# Altium project Wenzel_REF.PrjPCB (part 1 of 7)
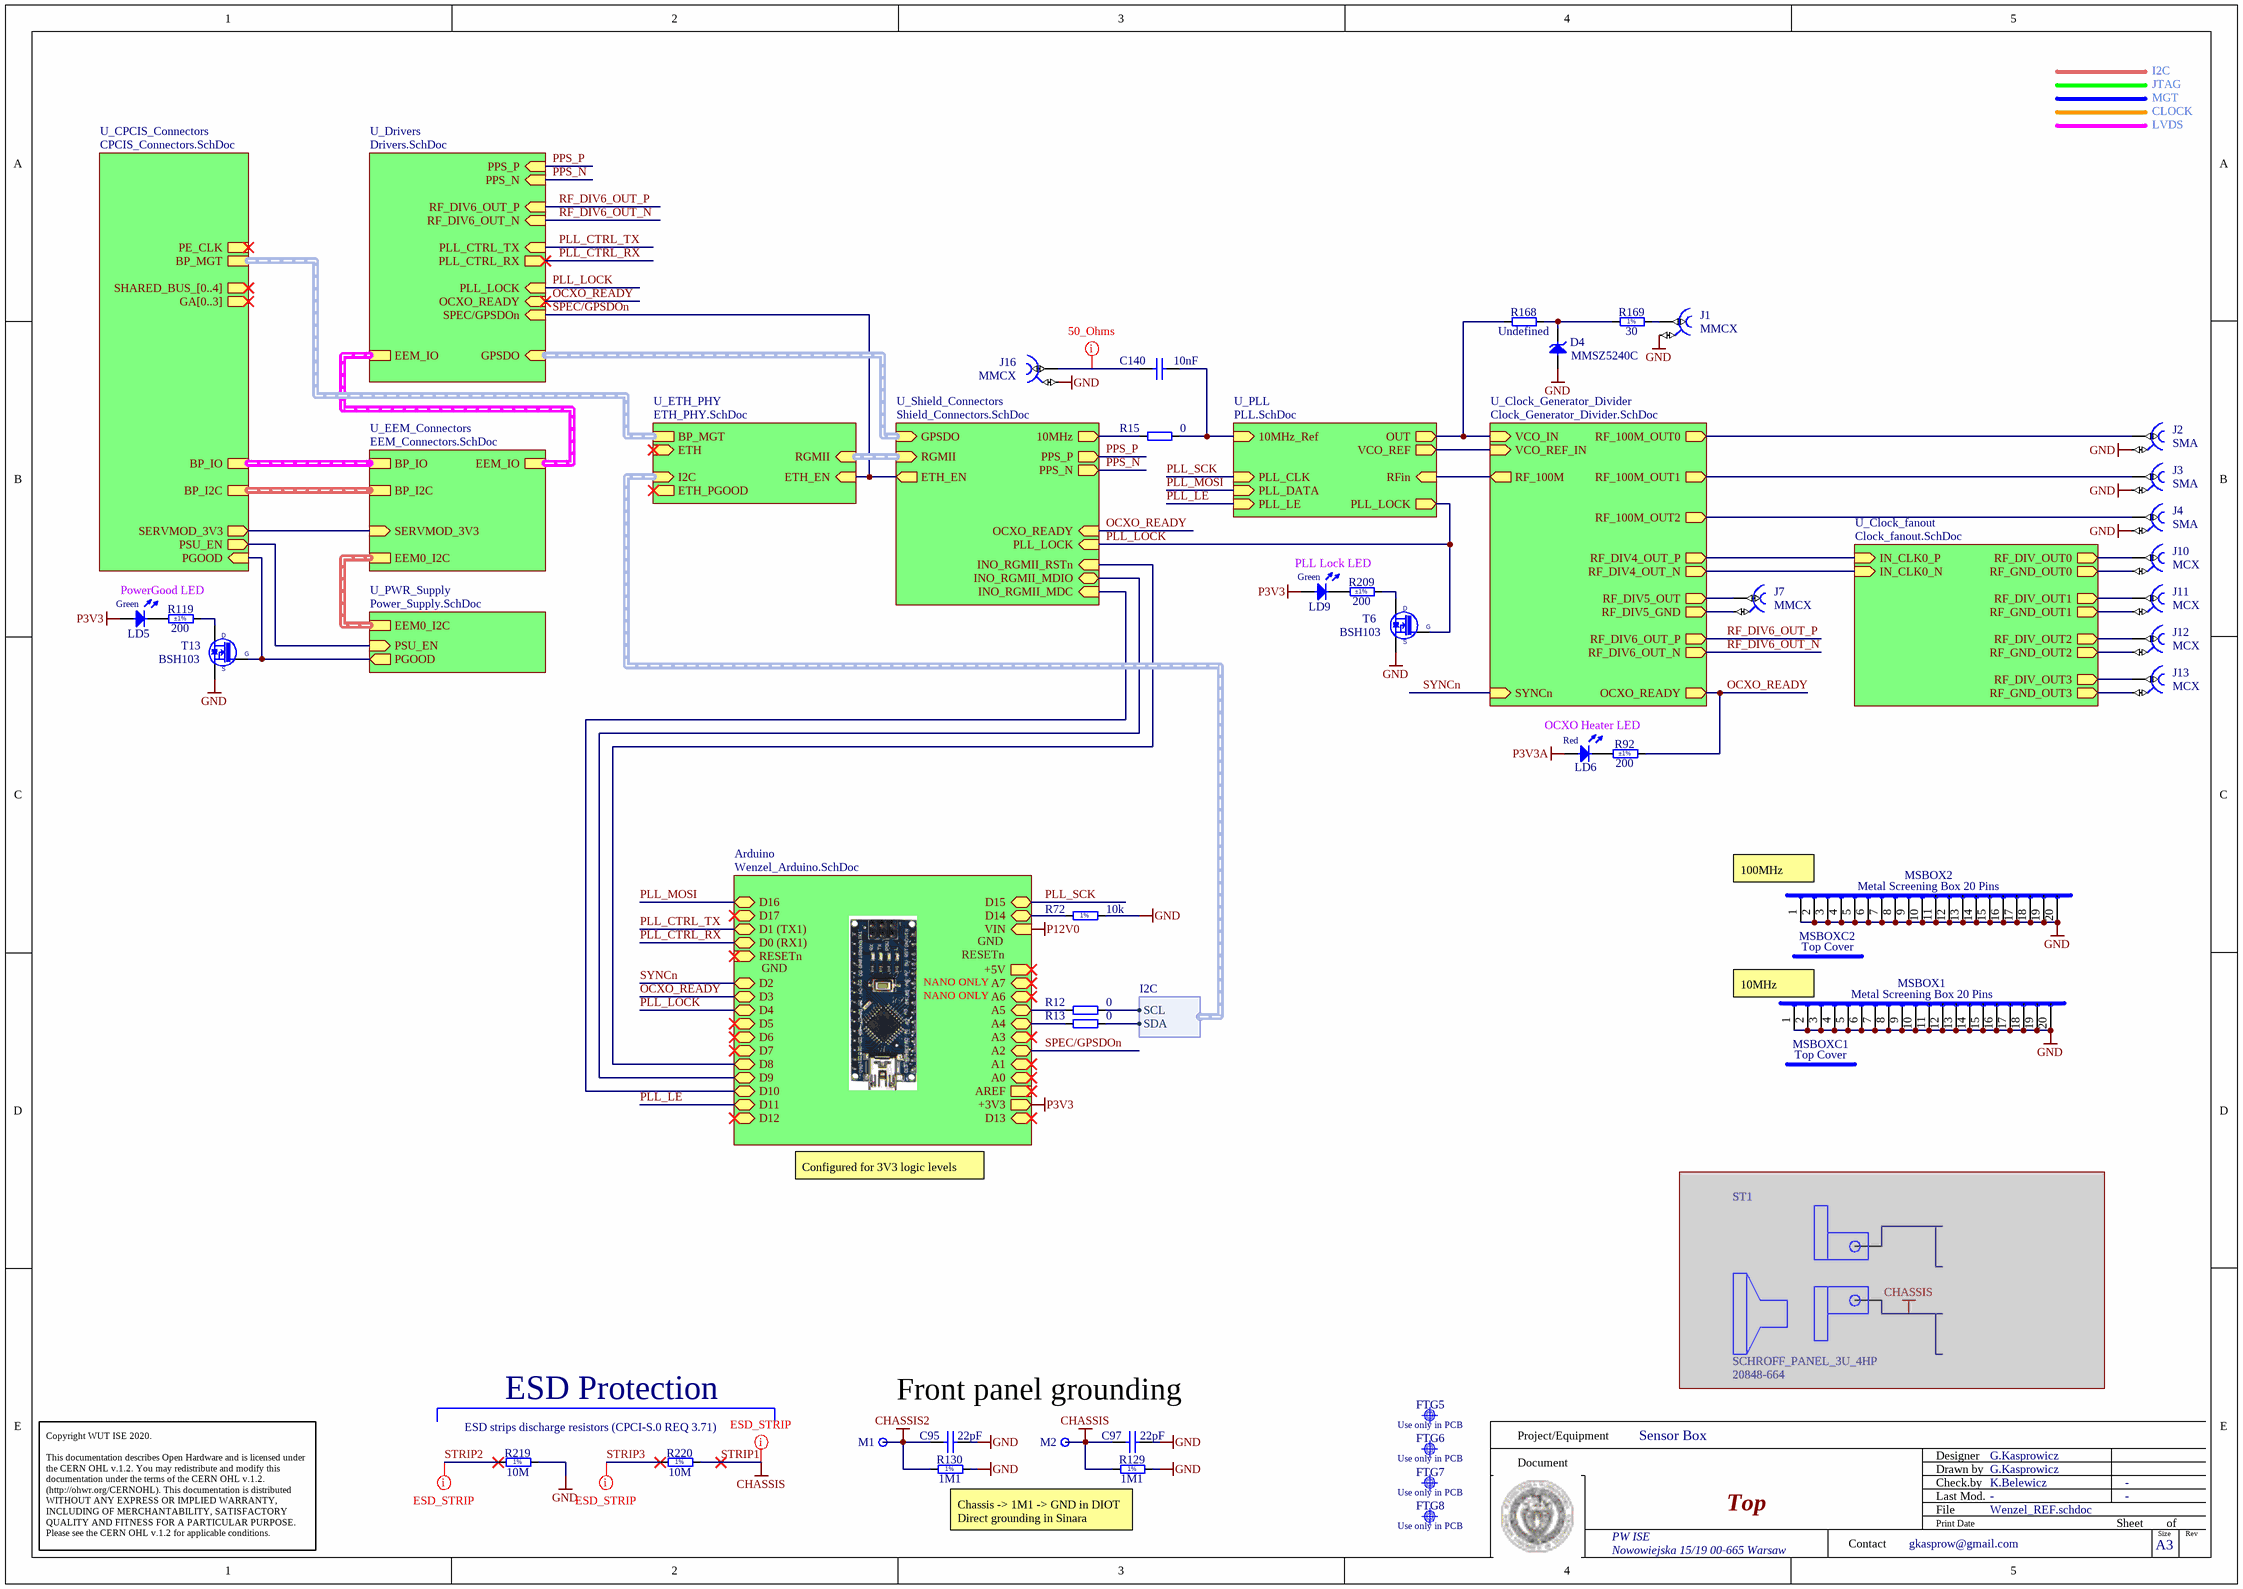
[diagram p0: Wenzel_REF.schdoc]
SheetTitle_Top: Wenzel-class Freq. Reference; ProjectRev: 1.1; Project: Wenzel; CheckedBy: K.Belewicz
11 sheets, 615 parts. Net scope: hierarchical (ports join the sheet entries above them; power ports are global).
Board file: Wenzel_REF.PCBDOC
Sheets:
  Wenzel_REF.schdoc
    U_Drivers = Drivers.SchDoc
    U_Clock_fanout = Clock_fanout.SchDoc
    U_Clock_Generator_Divider = Clock_Generator_Divider.SchDoc
    U_Shield_Connectors = Shield_Connectors.SchDoc
    U_ETH_PHY = ETH_PHY.SchDoc
    U_PWR_Supply = Power_Supply.SchDoc
    U_CPCIS_Connectors = CPCIS_Connectors.SchDoc
    U_EEM_Connectors = EEM_Connectors.SchDoc
    U_PLL = PLL.SchDoc
    Arduino = Wenzel_Arduino.SchDoc

## Sheet Wenzel_REF.schdoc: =SheetTitle_Top
size 420 x 297 mm; EDA_Number: ARTIQ; Projet: Wenzel; Author: G.Kasprowicz; CompanyName: WUT ISE; DrawnBy: G.Kasprowicz; Organization: WUT ISE; Address1: PW ISE; Address2: Nowowiejska 15/19 00-665 Warsaw; Address3: gkasprow@gmail.com; Revision: 1.1; ModifiedBy: -; CheckedDate: -; Title2: Top; DivGrp: WUT ISE; Designer: G.Kasprowicz; ModifiedDate: -; ProjectName: Sensor Box

### Parts
(Parts that share a designator on the sheet are numbered #1, #2 ... from top to bottom, then left to right.)
C95  22pF  [CAPC1005X55N]
C97  22pF  [CAPC1005X55N]
C140#1  10nF  [CAPC1005X55N]
D4  MMSZ5240C  [SOD3716X135N]
FTG5  Use only in PCB  [FIDUCIAL_TOP_C100-200]  (no BOM)
FTG6  Use only in PCB  [FIDUCIAL_TOP_S100-200]  (no BOM)
FTG7  Use only in PCB  [FIDUCIAL_TOP_S100-200]  (no BOM)
FTG8  Use only in PCB  [FIDUCIAL_TOP_S100-200]  (no BOM)
J1  MMCX  [SAMTEC_MMCX-J-P-H-ST-TH1]
J2  SMA  [MOLEX_73251-2120]
J3  SMA  [MOLEX_73251-2120]
J4  SMA  [MOLEX_73251-2120]
J7#1  MMCX  [SAMTEC_MMCX-J-P-H-ST-TH1]
J10  MCX  [AMPHENOL_919-383J-51A]
J11  MCX  [AMPHENOL_919-383J-51A]
J12  MCX  [AMPHENOL_919-383J-51A]
J13  MCX  [AMPHENOL_919-383J-51A]
J16  MMCX  [SAMTEC_MMCX-J-P-H-ST-TH1]
LD5  Green  [LED_DIALIGHT_555-230]
LD6  Red  [LED_DIALIGHT_555-200]
LD9  Green  [LED_DIALIGHT_555-230]
M1  Plated Hole  [MTG300_600]  (value not drawn)  (no BOM)
M2  Plated Hole  [MTG300_600]  (value not drawn)  (no BOM)
MSBOX1  Metal Screening Box 20 Pins  [MSBOX_LAIRD_BMI-S-204-F]
MSBOX2  Metal Screening Box 20 Pins  [MSBOX_LAIRD_BMI-S-204-F]
MSBOXC1  Top Cover  [MSBOX_LAIRD_BMI-S-204-C]
MSBOXC2  Top Cover  [MSBOX_LAIRD_BMI-S-204-C]
R12  0  [RESC1005X40N]
R13  0  [RESC1005X40N]
R15  0  [RESC1005X40N]
R72#1  10k  [RESC1005X40N]
R92  200  Tolerance: ±1%  [RESC1005X40N]
R119  200  Tolerance: ±1%  [RESC1005X40N]
R129  1M1  [RESC2012X60N]
R130  1M1  [RESC2012X60N]
R168  Undefined  [RESC1608X55N]
R169  30  [RESC1608X55N]
R209#1  200  Tolerance: ±1%  [RESC1005X40N]
R219  10M  [RESC2113X55N]
R220  10M  [RESC2113X55N]
ST1  SCHROFF_PANEL_3U_4HP  Manufacturer Part Number 2: 20848-664  [SCHROFF_PANEL_3HP_4U]  (masked out: inside a compile mask, not in the netlist)
T6  BSH103  [SOT95P230X110-3N]
T13  BSH103  [SOT95P230X110-3N]

### Sub-sheets
Arduino = Wenzel_Arduino.SchDoc: D16 (bidir), D2 (bidir), D3 (bidir), D1 (TX1) (bidir), D17 (bidir), D7 (bidir), D8 (bidir), D9 (bidir), D14 (bidir), D11 (bidir), D0 (RX1) (bidir), D10 (bidir), D6 (bidir), D15 (bidir), D4 (bidir), D5 (bidir), D12 (bidir), A7 (bidir), D13 (bidir), +3V3 (out), +5V (out), AREF, A1 (bidir), A3 (bidir), A4 (bidir), A2 (bidir), VIN (in), RESETn (in), A6 (bidir), A5 (bidir), A0 (bidir)
U_Clock_fanout = Clock_fanout.SchDoc: IN_CLK0_P (in), IN_CLK0_N (in), RF_DIV_OUT0 (out), RF_GND_OUT0 (out), RF_DIV_OUT1 (out), RF_DIV_OUT2 (out), RF_DIV_OUT3 (out), RF_GND_OUT1 (out), RF_GND_OUT2 (out), RF_GND_OUT3 (out)
U_Clock_Generator_Divider = Clock_Generator_Divider.SchDoc: RF_100M_OUT0 (out), RF_100M_OUT1 (out), RF_100M_OUT2 (out), SYNCn (in), VCO_IN (in), VCO_REF_IN (in), OCXO_READY (out), RF_DIV4_OUT_P (out), RF_DIV4_OUT_N (out), RF_DIV5_OUT (out), RF_DIV5_GND (out), RF_DIV6_OUT_P (out), RF_DIV6_OUT_N (out), RF_100M (out)
U_CPCIS_Connectors = CPCIS_Connectors.SchDoc: BP_I2C (harness I2C), SERVMOD_3V3 (out), PSU_EN (out), PE_CLK (harness CLK_DIFF), BP_MGT (harness MGT), GA[0..3] (out), BP_IO (harness EEM_LVDS), SHARED_BUS_[0..4] (out), PGOOD (in)
U_Drivers = Drivers.SchDoc: OCXO_READY (in), RF_DIV6_OUT_P (in), RF_DIV6_OUT_N (in), EEM_IO (harness EEM_LVDS), GPSDO (in, harness GPSDO), SPEC/GPSDOn (in), PLL_LOCK (in), PLL_CTRL_TX (in), PLL_CTRL_RX (out), PPS_P (in), PPS_N (in)
U_EEM_Connectors = EEM_Connectors.SchDoc: EEM_IO (harness EEM_LVDS), BP_IO (harness EEM_LVDS), EEM0_I2C (harness I2C), BP_I2C (harness I2C), SERVMOD_3V3 (in)
U_ETH_PHY = ETH_PHY.SchDoc: ETH_EN (in), ETH_PGOOD (out), RGMII (in, harness RGMII), I2C (in, harness I2C), ETH (in, harness SERDES), BP_MGT (harness MGT)
U_PLL = PLL.SchDoc: OUT (out), VCO_REF (out), 10MHz_Ref (in), RFin (in), PLL_CLK (in), PLL_LOCK (out), PLL_DATA (in), PLL_LE (in)
U_PWR_Supply = Power_Supply.SchDoc: PSU_EN (in), EEM0_I2C (harness I2C), PGOOD (out)
U_Shield_Connectors = Shield_Connectors.SchDoc: RGMII (in, harness RGMII), ETH_EN (out), 10MHz (out), PPS_P (out), GPSDO (in, harness GPSDO), PLL_LOCK (in), OCXO_READY (in), INO_RGMII_RSTn (in), INO_RGMII_MDIO (bidir), INO_RGMII_MDC (in), PPS_N (out)

### Harnesses
I2C: SCL, SDA

### Nets
CHASSIS: C97.1 M2.1 R129.1 R220.2  [also labelled STRIP1]
CHASSIS2: C95.1 M1.1 R130.1
GND: C95.2 C97.2 D4.2(A) J1.2 J2.2 J3.2 J4.2 J16.2 MSBOX1.1 MSBOX1.2 MSBOX1.3 MSBOX1.4 MSBOX1.5 MSBOX1.6 MSBOX1.7 MSBOX1.8 MSBOX1.9 MSBOX1.10 MSBOX1.11 MSBOX1.12 MSBOX1.13 MSBOX1.14 MSBOX1.15 MSBOX1.16 MSBOX1.17 MSBOX1.18 MSBOX1.19 MSBOX1.20 MSBOX2.1 MSBOX2.2 MSBOX2.3 MSBOX2.4 MSBOX2.5 MSBOX2.6 MSBOX2.7 MSBOX2.8 MSBOX2.9 MSBOX2.10 MSBOX2.11 MSBOX2.12 MSBOX2.13 MSBOX2.14 MSBOX2.15 MSBOX2.16 MSBOX2.17 MSBOX2.18 MSBOX2.19 MSBOX2.20 R72#1.2 R129.2 R130.2 R219.2 T6.2(S) T13.2(S)
P3V3: LD5.2(A) LD9.2(A) ; sheet Arduino/+3V3
P3V3A: LD6.2(A)
10MHz: R15.2 ; sheet U_Shield_Connectors/10MHz
10MHz_Ref: C140#1.1 R15.1 ; sheet U_PLL/10MHz_Ref
A4: R13.2 ; sheet Arduino/A4
A5: R12.2 ; sheet Arduino/A5
D8: sheet U_Shield_Connectors/INO_RGMII_RSTn, sheet Arduino/D8
D9: sheet U_Shield_Connectors/INO_RGMII_MDIO, sheet Arduino/D9
D10: sheet U_Shield_Connectors/INO_RGMII_MDC, sheet Arduino/D10
D14 (MISO): R72#1.1 ; sheet Arduino/D14
IN_CLK0_N: sheet U_Clock_fanout/IN_CLK0_N, sheet U_Clock_Generator_Divider/RF_DIV4_OUT_N
IN_CLK0_P: sheet U_Clock_fanout/IN_CLK0_P, sheet U_Clock_Generator_Divider/RF_DIV4_OUT_P
OCXO_READY: R92.2 ; sheet U_Drivers/OCXO_READY, sheet U_Clock_Generator_Divider/OCXO_READY, sheet U_Shield_Connectors/OCXO_READY, sheet Arduino/D3  [project net D3]
PGOOD: T13.1(G) ; sheet U_PWR_Supply/PGOOD, sheet U_CPCIS_Connectors/PGOOD
PLL_CTRL_RX: sheet U_Drivers/PLL_CTRL_RX, sheet Arduino/D0 (RX1)
PLL_CTRL_TX: sheet U_Drivers/PLL_CTRL_TX, sheet Arduino/D1 (TX1)
PLL_LE: sheet U_PLL/PLL_LE, sheet Arduino/D11  [project net D11]
PLL_LOCK: T6.1(G) ; sheet U_Drivers/PLL_LOCK, sheet U_Shield_Connectors/PLL_LOCK, sheet U_PLL/PLL_LOCK, sheet Arduino/D4  [project net D4]
PLL_MOSI: sheet U_PLL/PLL_DATA, sheet Arduino/D16
PLL_SCK: sheet U_PLL/PLL_CLK, sheet Arduino/D15  [project net D15 (SCK)]
PPS_N: sheet U_Drivers/PPS_N, sheet U_Shield_Connectors/PPS_N  [project net DELAY_Q1_N]
PPS_P: sheet U_Drivers/PPS_P, sheet U_Shield_Connectors/PPS_P  [project net DELAY_Q1_P]
PSU_EN: sheet U_PWR_Supply/PSU_EN, sheet U_CPCIS_Connectors/PSU_EN
RF_100M: sheet U_Clock_Generator_Divider/RF_100M, sheet U_PLL/RFin
RF_100M_OUT0: J2.1 ; sheet U_Clock_Generator_Divider/RF_100M_OUT0
RF_100M_OUT1: J3.1 ; sheet U_Clock_Generator_Divider/RF_100M_OUT1
RF_100M_OUT2: J4.1 ; sheet U_Clock_Generator_Divider/RF_100M_OUT2
RF_DIV5_GND: J7#1.2 ; sheet U_Clock_Generator_Divider/RF_DIV5_GND
RF_DIV5_OUT: J7#1.1 ; sheet U_Clock_Generator_Divider/RF_DIV5_OUT
RF_DIV6_OUT_N: sheet U_Drivers/RF_DIV6_OUT_N, sheet U_Clock_Generator_Divider/RF_DIV6_OUT_N  [project net EEM_IO.LVDS_N0]
RF_DIV6_OUT_P: sheet U_Drivers/RF_DIV6_OUT_P, sheet U_Clock_Generator_Divider/RF_DIV6_OUT_P  [project net EEM_IO.LVDS_P0]
RF_DIV_OUT0: J10.1 ; sheet U_Clock_fanout/RF_DIV_OUT0
RF_DIV_OUT1: J11.1 ; sheet U_Clock_fanout/RF_DIV_OUT1
RF_DIV_OUT2: J12.1 ; sheet U_Clock_fanout/RF_DIV_OUT2
RF_DIV_OUT3: J13.1 ; sheet U_Clock_fanout/RF_DIV_OUT3
RF_GND_OUT0: J10.2 ; sheet U_Clock_fanout/RF_GND_OUT0
RF_GND_OUT1: J11.2 ; sheet U_Clock_fanout/RF_GND_OUT1
RF_GND_OUT2: J12.2 ; sheet U_Clock_fanout/RF_GND_OUT2
RF_GND_OUT3: J13.2 ; sheet U_Clock_fanout/RF_GND_OUT3
SERVMOD_3V3: sheet U_CPCIS_Connectors/SERVMOD_3V3, sheet U_EEM_Connectors/SERVMOD_3V3
SPEC/GPSDOn: sheet U_Drivers/SPEC/GPSDOn, sheet U_Shield_Connectors/ETH_EN, sheet U_ETH_PHY/ETH_EN, sheet Arduino/A2  [project net A2]
STRIP2: R219.1
STRIP3: R220.1
SYNCn: sheet U_Clock_Generator_Divider/SYNCn, sheet Arduino/D2  [project net D2]
VCO_IN: R168.1 ; sheet U_Clock_Generator_Divider/VCO_IN, sheet U_PLL/OUT
VCO_REF_IN: sheet U_Clock_Generator_Divider/VCO_REF_IN, sheet U_PLL/VCO_REF
NetC140#1_2: C140#1.2 J16.1
NetD4_1: D4.1(C) R168.2 R169.1
NetIC20_3: R13.1 ; sheet U_ETH_PHY/I2C.SDA
NetIC20_4: R12.1 ; sheet U_ETH_PHY/I2C.SCL
NetJ1_1: J1.1 R169.2
NetLD5_1: LD5.1(C) R119.1
NetLD6_1: LD6.1(C) R92.1
NetLD9_1: LD9.1(C) R209#1.1
NetR119_2: R119.2 T13.3(D)
NetR209#1_2: R209#1.2 T6.3(D)

### Buses and harness runs
harness sheet U_CPCIS_Connectors/BP_I2C = sheet U_EEM_Connectors/BP_I2C
harness sheet U_CPCIS_Connectors/BP_IO = sheet U_EEM_Connectors/BP_IO
harness sheet U_CPCIS_Connectors/BP_MGT = sheet U_ETH_PHY/BP_MGT
harness sheet U_Drivers/EEM_IO = sheet U_EEM_Connectors/EEM_IO
harness sheet U_Drivers/GPSDO = sheet U_Shield_Connectors/GPSDO
harness sheet U_EEM_Connectors/EEM0_I2C = sheet U_PWR_Supply/EEM0_I2C
harness sheet U_ETH_PHY/RGMII = sheet U_Shield_Connectors/RGMII

### Layout directives
net class ESD_STRIP: CHASSIS, STRIP2, STRIP3
net class 50_Ohms: NetC140#1_2

### Notes on the sheet
- I2C
- JTAG
- MGT
- CLOCK
- LVDS
- PowerGood LED
- PLL Lock LED
- OCXO Heater LED
- (near MSBOX2) 100MHz
- GND
- NANO ONLY
- RESETn
- 10MHz
- Configured for 3V3 logic levels
- ESD Protection
- Front panel grounding
- ESD strips discharge resistors (CPCI-S.0 REQ 3.71)
- Chassis -> 1M1 -> GND in DIOT
  Direct grounding in Sinara
- Project/Equipment
- Document
- Designer
- Drawn by
- Check.by
- Copyright WUT ISE 2020.
  This documentation describes Open Hardware and is licensed under the CERN OHL v.1.2. You may redistribute and modify this documentation under the terms of the CERN OHL v.1.2. (http://ohwr.org/CERNOHL). This documentation is distributed WITHOUT ANY EXPRESS OR IMPLIED WARRANTY, INCLUDING OF MERCHANTABILITY, SATISFACTORY QUALITY AND FITNESS FOR A PARTICULAR PURPOSE. Please see the CERN OHL v.1.2 for applicable conditions.
- Contact
- File
- Last Mod.
- Print Date
- Sheet
- Size
- A3
- of
- Rev
- (in symbol R0402_10K_1%_0.0625W_100PPM) 1%
- (in symbol R0603_30R_1%_0.1W_100PPM) 1%
- (in symbol R0805_1M1_1%_0.125W_100PPM) 1%
- (in symbol R0805_10M_1%_0.125W_100PPM_VISHAY_CRCW e3) 1%

### Library data of the parts
C95 C97 = CC0402_22PF_50V_5%_C0G: Non-polarised capacitor; Part Description: SMD Multilayer Chip Ceramic Capacitor; Manufacturer: GENERIC; Manufacturer1 Part Number: C0402C220J5GACTU; Voltage: 50V; TC: C0G/NP0; Tolerance: ±5%; Part Number: CC0402_22PF_50V_5%_C0G; Component Kind: Standard; Component Type: Standard; Pin Count: 2; Value: 22pF; Status: Preferred; Manufacturer Part Number: CC0402_22PF_50V_5%_C0G; Case: 0402; Mounted: Yes; Socket: No; SMD: Yes; Manufacturer1 Example: KEMET; Manufacturer1 ComponentHeight: 0.55mm; HelpURL: \\cern.ch\dfs\Applications\Altium\Datasheets\CC0402_C0G_KEMET_(Commercial Grade).pdf; Author: CERN DEM JLC; CreateDate: 2007-12-03; LatestRevisionDate: 2007-12-03; Sense: No
C140#1 = CC0402_10NF_16V_10%_X7R: Non-polarised capacitor; Part Description: SMD Multilayer Chip Ceramic Capacitor; Manufacturer: GENERIC; Manufacturer1 Part Number: 223878715636; Voltage: 16V; TC: X7R; Tolerance: ±10%; Part Number: CC0402_10NF_16V_10%_X7R; Component Kind: Standard; Component Type: Standard; Pin Count: 2; Value: 10nF; Status: Not Recommended; Manufacturer Part Number: CC0402_10NF_16V_10%_X7R; Case: 0402; Mounted: Yes; Socket: No; SMD: Yes; Sense: No; Manufacturer1 Example: PHYCOMP; Manufacturer1 ComponentHeight: 0.55mm; HelpURL: \\cern.ch\dfs\Applications\Altium\Datasheets\CC0402_X7R_PHYCOMP.pdf; Author: CERN DEM JLC; CreateDate: 2007-12-03; LatestRevisionDate: 2007-12-03
D4 = MMSZ5240C: Zener Diode; Part Description: Small Signal Zener Diode; Manufacturer: VISHAY SEMICONDUCTORS; Voltage: 10V; Power: 500mW; PressFit: No; Bonding: No; Part Number: MMSZ5240C; Component Kind: Standard; Component Type: Standard; Device: MMSZ5240C; PackageDescription: Diode (SOD-123), 2.70mm W X 1.60mm L X 1.35mm H body, IPC Medium Density; Manufacturer Part Number: MMSZ5240C; Pin Count: 2; Case: SOD-123; Mounted: Yes; Socket: No; SMD: Yes; Sense: No; ComponentHeight: 1.35mm; HelpURL: \\cern.ch\dfs\Applications\Altium\Datasheets\MMSZ5248B-E3-08.pdf; Author: CERN DEM HF; CreateDate: 23.05.2022; LatestRevisionDate: 23.05.2022
FTG5 = FIDUCIAL_TARGET_C100-200: Fiducial Target; Part Description: Round Fiducial Target, Top Layer, 1.0mm, Top Solder 2.0mm, Keepout =2.0mm; Mounted: No; Part Number: FIDUCIAL_TARGET_C100-200; Component Type: Standard (No BOM); Pin Count: 1; Family: Fiducial; Socket: No; SMD: Yes; Sense: No; Status: None; ComponentHeight: 0mm; HelpURL: Undefined; Author: CERN DEM JLC; CreateDate: 09.02.2010; LatestRevisionDate: 04.04.2012; PackageDescription: Round Fiducial Target, Top Layer, 1.0mm, Top Solder 2.0mm, Keepout =2.0mm
FTG6-FTG8 = FIDUCIAL_TARGET_S100-200: Fiducial Target; Part Description: Square Fiducial Target, Top Layer, 1.0mm, Top Solder 2.0mm, Keepout =2.0mm; Mounted: No; Part Number: FIDUCIAL_TARGET_S100-200; Component Type: Standard (No BOM); Pin Count: 1; Family: Fiducial; Socket: No; SMD: Yes; Sense: No; Status: None; ComponentHeight: 0mm; HelpURL: Undefined; Author: CERN DEM JLC; CreateDate: 09.02.2010; LatestRevisionDate: 04.04.2012; PackageDescription: Square Fiducial Target, Top Layer, 1.0mm, Top Solder 2.0mm, Keepout =2.0mm
J1 J7#1 J16 = SAMTEC_MMCX-J-P-H-ST-TH1: Part Description: Straight Through-hole 50 Ohms Micro Mini RF Jack, MMCX Series; Manufacturer: SAMTEC; PressFit: No; Part Number: SAMTEC_MMCX-J-P-H-ST-TH1; Component Kind: Standard; Component Type: Standard; Pin Count: 2; Mounted: Yes; Socket: No; SMD: No; Sense: No; Status: None; Manufacturer Part Number: MMCX-J-P-H-ST-TH1; ComponentHeight: 4.35mm; HelpURL: \\cern.ch\dfs\Applications\Altium\Datasheets\SAMTEC_MMCX-J-P-H-ST-TH1.pdf; Author: CERN DEM JLC; CreateDate: 05.12.2012; LatestRevisionDate: 05.12.2012
J2-J4 = CON_SMA_RA_SMD_73251-2120: 50 Ohm, SMA Edge Mount PCB, With Jam Nut And Lock Washer; Manufacturer: MOLEX; PressFit: No; Part Number: MOLEX_73251-2120; Component Kind: Standard; Component Type: Standard; Pin Count: 5; Family: SMA; Mounted: Yes; Socket: No; SMD: Yes; Sense: No; Status: None; Part Description: 50 Ohm, SMA Edge Mount PCB, With Jam Nut And Lock Washer; Manufacturer Part Number: 73251-2120; ComponentHeight: 5.75mm; HelpURL: \\cern.ch\dfs\Applications\Altium\Datasheets\MOLEX_73251-2121.pdf; Author: CERN DEM JLC; CreateDate: 26.10.2016; LatestRevisionDate: 26.10.2016
J10-J13 = AMPHENOL_919-383J-51A: Part Description: 50 Ohm, RF Connector, MCX Right Angle PCB Receptacle Jack; PressFit: No; Part Number: AMPHENOL_919-383J-51A; Component Kind: Standard; Component Type: Standard; Pin Count: 5; Family: MCX; Mounted: Yes; Socket: No; SMD: No; Sense: No; Status: None; Manufacturer: AMPHENOL; Manufacturer Part Number: 919-383J-51A; ComponentHeight: 6mm; HelpURL: \\cern.ch\dfs\Applications\Altium\Datasheets\AMPHENOL_919-383J-51A.pdf; Author: CERN DEM BC; CreateDate: 31.01.2019; LatestRevisionDate: 31.01.2019
LD5 LD9 = LED_DIALIGHT_555-2301F: LED Green 1C 2A; Part Description: Single 2mm Green LED CBI® Circuit Board Indicator; PressFit: No; Bonding: No; Part Number: LED_DIALIGHT_555-2301F; Component Kind: Standard; Component Type: Standard; Color: Green; PackageDescription: Single 2mm Green LED, Body 5.08x2.54mm, Pin spacing 2.54mm; Manufacturer: DIALIGHT; Manufacturer Part Number: 555-2301F; Pin Count: 2; Mounted: Yes; Socket: No; SMD: No; Sense: No; ComponentHeight: 6.35mm; HelpURL: \\cern.ch\dfs\Applications\Altium\Datasheets\LED_DIALIGHT_555-2301F.pdf; Author: CERN DEM JMW; CreateDate: 22.09.2008; LatestRevisionDate: 17.03.2010
LD6 = LED_DIALIGHT_555-2001F: LED Red 1C 2A; Part Description: Single 2mm Red LED CBI® Circuit Board Indicator; PressFit: No; Bonding: No; Part Number: LED_DIALIGHT_555-2001F; Component Kind: Standard; Component Type: Standard; Color: Red; PackageDescription: Single 2mm Red LED, Body 5.08x2.54mm, Pin spacing 2.54mm; Manufacturer: DIALIGHT; Manufacturer Part Number: 555-2001F; Pin Count: 2; Mounted: Yes; Socket: No; SMD: No; Sense: No; ComponentHeight: 6.35mm; HelpURL: \\cern.ch\dfs\Applications\Altium\Datasheets\LED_DIALIGHT_555-2001F.pdf; Author: CERN DEM JMW; CreateDate: 22.09.2008; LatestRevisionDate: 17.03.2010
M1 M2 = PLATED_HOLE3.0_PAD6.0: Single Terminal Socket; Part Description: Plated Through Hole: Hole Dia.=3.0mm Pad Dia.=6.0mm; Mounted: No; Table: Pads; Part Number: PLATED_HOLE3.0_PAD6.0; Component Type: Standard (No BOM); Designator: Single Terminal Socket; Library Reference: Single Terminal Socket; Pin Count: 1; Family: Plated Hole; Socket: No; SMD: No; Status: None; ComponentHeight: 0mm; Author: CERN DEM JLC; CreateDate: 26.05.2008; LatestRevisionDate: 26.05.2008; PackageDescription: Plated Through Hole: Hole Dia.=3.0mm Pad Dia.=6.0mm
MSBOX1 MSBOX2 = MSBOX_LAIRD_BMI-S-204-F: Part Description: Frame of Standard Surface Mount Shield (Two Piece), External Dimensions 32 x 32mm; Manufacturer: LAIRD; PressFit: No; Part Number: MSBOX_LAIRD_BMI-S-204-F; Component Kind: Standard; Component Type: Standard; Pin Count: 20; PackageDescription: Frame of Standard Surface Mount Shield (Two Piece), External Dimensions 32 x 32mm; Mounted: Yes; Socket: No; SMD: Yes; Sense: No; Status: None; Manufacturer Part Number: BMI-S-204-F; ComponentHeight: 6mm; HelpURL: \\cern.ch\dfs\Applications\Altium\Datasheets\MSBOX_LAIRD_BMI-S-205-F.pdf; Author: CERN DEM JLC; CreateDate: 21.06.2017; LatestRevisionDate: 21.06.2017
MSBOXC1 MSBOXC2 = MSBOX_LAIRD_BMI-S-204-C: Metal Screening Box - Top Cover 0 Pin; Part Description: Cover for Frame of Standard Surface Mount Shield (Two Piece), External Dimensions 32.46 x 32.46mm; Manufacturer: LAIRD; PressFit: No; Part Number: MSBOX_LAIRD_BMI-S-204-C; Component Kind: Accessories; Component Type: Standard; Pin Count: 0; PackageDescription: Cover for Frame of Standard Surface Mount Shield (Two Piece), External Dimensions 32.46 x 32.46mm; Mounted: Yes; Socket: No; SMD: Yes; Sense: No; Status: None; Manufacturer Part Number: BMI-S-204-C; ComponentHeight: 2mm; HelpURL: \\cern.ch\dfs\Applications\Altium\Datasheets\MSBOX_LAIRD_BMI-S-205-C.pdf; Author: CERN DEM JLC; CreateDate: 21.06.2017; LatestRevisionDate: 21.06.2017
R12 R13 R15 = R0402_0R_JUMPER: Resistor; Part Description: 1A (0.05R Max DC Resistance) Zero Ohm Jumper; Manufacturer: GENERIC; Manufacturer1 Part Number: 232270591001L; Part Number: R0402_0R_JUMPER; Component Kind: Standard; Component Type: Standard; Pin Count: 2; Value: 0; Status: Not recommended; Manufacturer Part Number: R0402_0R_JUMPER; Case: 0402; Mounted: Yes; Sense: No; Socket: No; SMD: Yes; Manufacturer1 Example: YAGEO PHYCOMP; Manufacturer1 ComponentHeight: 0.4mm; HelpURL: \\cern.ch\dfs\Applications\Altium\Datasheets\R0402_Phycomp_RC0402.pdf; Author: CERN DEM JLC; CreateDate: 03.12.2007; LatestRevisionDate: 17.10.2012
R72#1 = R0402_10K_1%_0.0625W_100PPM: Resistor - 1%; Part Description: General Purpose Thick Film Chip Resistor; Manufacturer: GENERIC; Manufacturer1 Part Number: 232270671003L; TC: ±100ppm/°C; PressFit: No; Part Number: R0402_10K_1%_0.0625W_100PPM; Component Kind: Standard; Component Type: Standard; Pin Count: 2; Value: 10k; Status: Not Recommended; Power: 0.0625W; Tolerance: ±1%; Manufacturer Part Number: R0402_10K_1%_0.0625W_100PPM; Case: 0402; Mounted: Yes; Sense: No; Socket: No; SMD: Yes; Manufacturer1 Example: YAGEO PHYCOMP; Manufacturer1 ComponentHeight: 0.4mm; HelpURL: \\cern.ch\dfs\Applications\Altium\Datasheets\R0402_Phycomp_RC0402.pdf; Author: CERN DEM JLC; CreateDate: 03.12.2007; LatestRevisionDate: 17.10.2012
R92 R119 R209#1 = R0402_200R_1%_0.0625W_100PPM: Resistor - 1%; Part Description: General Purpose Thick Film Chip Resistor; Manufacturer: GENERIC; Manufacturer1 Part Number: 232270672001L; TC: ±100ppm/°C; PressFit: No; Part Number: R0402_200R_1%_0.0625W_100PPM; Component Kind: Standard; Component Type: Standard; Pin Count: 2; Value: 200; Status: Not Recommended; Power: 0.0625W; Manufacturer Part Number: R0402_200R_1%_0.0625W_100PPM; Case: 0402; Mounted: Yes; Sense: No; Socket: No; SMD: Yes; Manufacturer1 Example: YAGEO PHYCOMP; Manufacturer1 ComponentHeight: 0.4mm; HelpURL: \\cern.ch\dfs\Applications\Altium\Datasheets\R0402_Phycomp_RC0402.pdf; Author: CERN DEM JLC; CreateDate: 03.12.2007; LatestRevisionDate: 17.10.2012
R129 R130 = R0805_1M1_1%_0.125W_100PPM: Resistor - 1%; Part Description: General Purpose Thick Film Chip Resistor; Manufacturer: GENERIC; Manufacturer1 Part Number: NRC10F1104TRF; PressFit: No; Part Number: R0805_1M1_1%_0.125W_100PPM; Component Kind: Standard; Component Type: Standard; Pin Count: 2; Value: 1M1; Status: Preferred; Manufacturer Part Number: R0805_1M1_1%_0.125W_100PPM; Case: 0805; Mounted: Yes; Sense: No; Socket: No; SMD: Yes; Manufacturer1 Example: NIC COMPONENT; Manufacturer1 ComponentHeight: 0.6mm; HelpURL: \\cern.ch\dfs\Applications\Altium\Datasheets\R0805_NIC_NRC.pdf; Author: CERN DEM JLC; CreateDate: 03/12/2007; LatestRevisionDate: 13/03/2008
R168 = R0603_NO-VALUE: Resistor; Part Description: Reserved Footprint For a 0603 (1608) Chip Resistor; PressFit: No; Mounted: No; Part Number: R0603_NO-VALUE; Component Kind: Standard; Component Type: Standard; Pin Count: 2; Value: Undefined; Status: None; Manufacturer: Undefined; Manufacturer Part Number: R0603_NO-VALUE; Case: 0603; Sense: No; Socket: No; SMD: Yes; Manufacturer1 Example: Undefined; Manufacturer1 Part Number: Undefined; Manufacturer1 ComponentHeight: Undefined; HelpURL: Undefined; Author: CERN DEM JLC; CreateDate: 03.12.2007; LatestRevisionDate: 13.03.2008
R169 = R0603_30R_1%_0.1W_100PPM: Resistor - 1%; Part Description: General Purpose Thick Film Chip Resistor; Manufacturer: GENERIC; Manufacturer1 Part Number: NRC06F30R0TRF; Power: 0.1W; TC: ±100ppm/°C; PressFit: No; Part Number: R0603_30R_1%_0.1W_100PPM; Component Kind: Standard; Component Type: Standard; Pin Count: 2; Value: 30; Status: Preferred; Tolerance: ±1%; Manufacturer Part Number: R0603_30R_1%_0.1W_100PPM; Case: 0603; Mounted: Yes; Sense: No; Socket: No; SMD: Yes; Manufacturer1 Example: NIC COMPONENT; Manufacturer1 ComponentHeight: 0.55mm; HelpURL: \\cern.ch\dfs\Applications\Altium\Datasheets\R0603_NIC_NRC.pdf; Author: CERN DEM JLC; CreateDate: 03/12/2007; LatestRevisionDate: 13/03/2008
R219 R220 = R0805_10M_1%_0.125W_100PPM_VISHAY_CRCW e3: Resistor - 1%; Part Description: 150V, Standard Thick Film Chip Resistor; Manufacturer: VISHAY DALE; Manufacturer Part Number: CRCW080510M0FKEA; Power: 0.125W; TC: ±100ppm/°C; PressFit: No; Part Number: R0805_10M_1%_0.125W_100PPM_VISHAY_CRCW e3; Component Kind: Standard; Component Type: Standard; Pin Count: 2; Value: 10M; Status: None; Tolerance: ±1%; Case: 0805; Mounted: Yes; Sense: No; Socket: No; SMD: Yes; ComponentHeight: 0.5mm; HelpURL: \\cern.ch\dfs\Applications\Altium\Datasheets\R0805_VISHAY_CRCW e3.pdf; Author: CERN DEM BC; CreateDate: 2019-11-12; LatestRevisionDate: 2019-11-12
ST1 = SCHROFF_PANEL_3U_4HP: Schroff 3HP 4U EUROCARD Panel Kit; Manufacturer Part Number: 20818-017; Manufacturer: Schroff
T6 T13 = BSH103: N-CHANNEL MOSFET WITH DIODE; Part Description: 30V 850mA N-Channel Enhancement Mode Field-Effect Transistor; Manufacturer: NEXPERIA; PressFit: No; Bonding: No; Part Number: BSH103; Component Kind: Standard; Component Type: Standard; Device: BSH103; PackageDescription: SOT23, 0.95mm Pitch; 3 Pin, 1.30mm W X 2.90mm L X 1.10mm H body, IPC Medium Density; Manufacturer Part Number: BSH103; Pin Count: 3; Case: SOT23-3; Mounted: Yes; Socket: No; SMD: Yes; Sense: No; ComponentHeight: 1.1mm; HelpURL: \\cern.ch\dfs\Applications\Altium\Datasheets\BSH103.pdf; Author: CERN DEM JLC; CreateDate: 16.03.2010; LatestRevisionDate: 20.06.2017

## Sheet Drivers.SchDoc: =SheetTitle_Top
size 420 x 297 mm; Author: G.Kasprowicz; CompanyName: WUT ISE; DrawnBy: G.Kasprowicz; Organization: WUT ISE; Address1: PW ISE; Address2: Nowowiejska 15/19 00-665 Warsaw; Address3: gkasprow@gmail.com; Revision: 1.1; ModifiedBy: -; CheckedDate: -; Title2: EEM transceivers; DivGrp: WUT ISE; Designer: G.Kasprowicz; SPICEModelCachePJWOAGJC: <root> / <DocumentId>PJWOAGJC</DocumentId> / </root>; ModifiedDate: -; ProjectName: Sensor Box
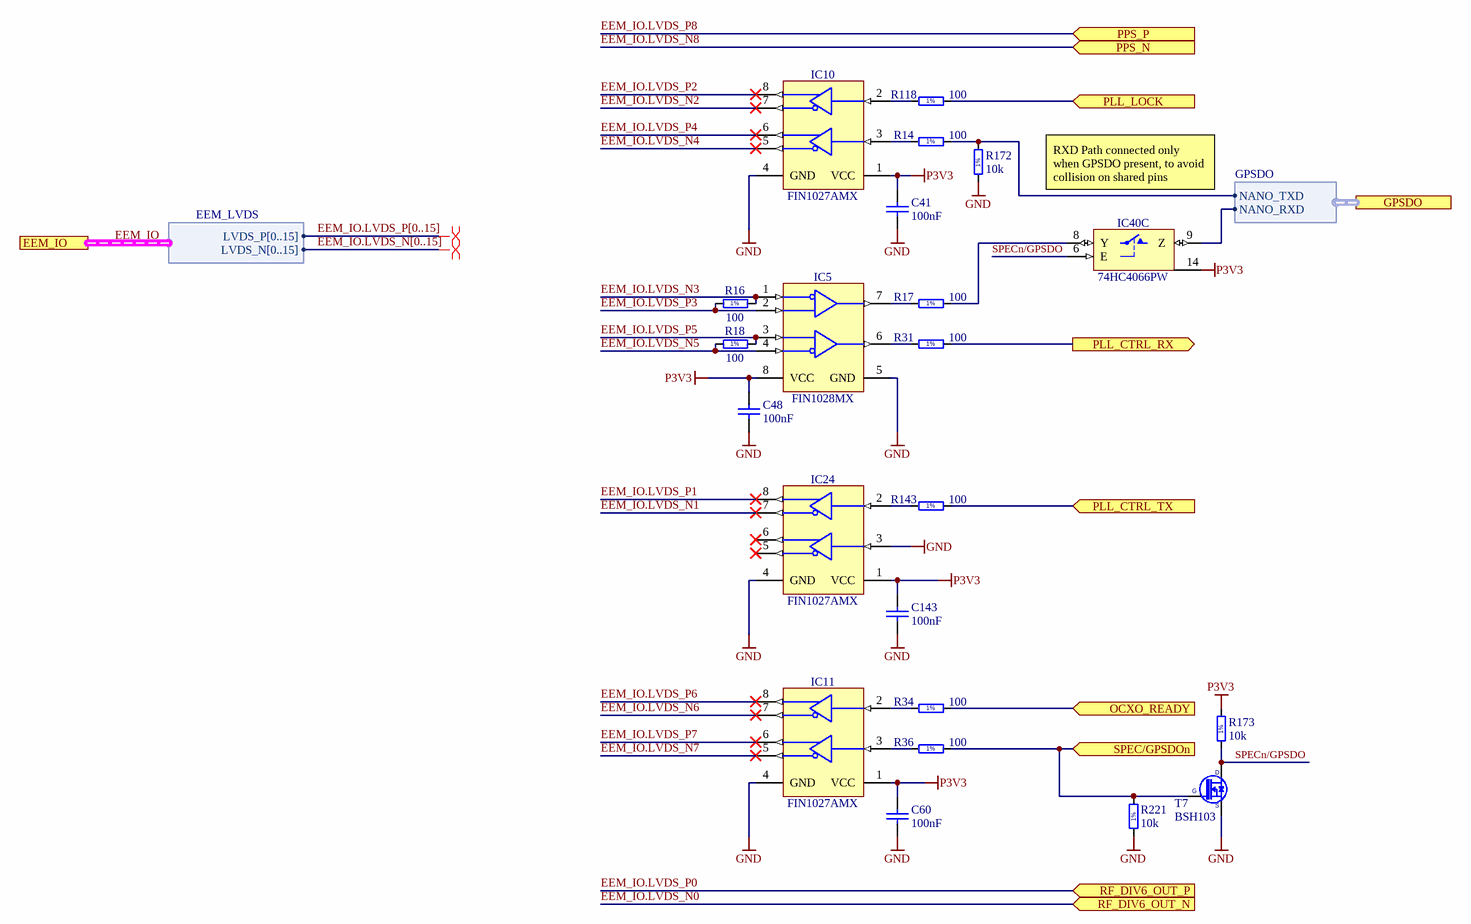
[diagram p1: Drivers.SchDoc]

### Parts
(Parts that share a designator on the sheet are numbered #1, #2 ... from top to bottom, then left to right.)
C41  100nF  [CAPC1005X55N]
C48  100nF  [CAPC1005X55N]
C60  100nF  [CAPC1005X55N]
C143  100nF  [CAPC1005X55N]
IC5  FIN1028MX  [SOIC127P600X175-8N]
IC10  FIN1027AMX  [SOIC127P600X175-8N]
IC11  FIN1027AMX  [SOIC127P600X175-8N]
IC24  FIN1027AMX  [SOIC127P600X175-8N]
IC40  74HC4066PW  [SOP65P640X110-14N]  (part C of 4)
R14  100  [RESC1005X40N]
R16  100  [RESC1005X40N]
R17  100  [RESC1005X40N]
R18  100  [RESC1005X40N]
R31  100  [RESC1005X40N]
R34  100  [RESC1005X40N]
R36  100  [RESC1005X40N]
R118#1  100  [RESC1005X40N]
R143#1  100  [RESC1005X40N]
R172  10k  [RESC1005X40N]
R173  10k  [RESC1005X40N]
R221  10k  [RESC1005X40N]
T7  BSH103  [SOT95P230X110-3N]

### Ports
EEM_IO (harness EEM_LVDS), GPSDO (harness GPSDO), OCXO_READY (in), PLL_CTRL_RX (out), PLL_CTRL_TX (in), PLL_LOCK (in), PPS_N (in), PPS_P (in), RF_DIV6_OUT_N (in), RF_DIV6_OUT_P (in), SPEC/GPSDOn (in)

### Harnesses
EEM_LVDS: LVDS_P[0..15], LVDS_N[0..15]
GPSDO: NANO_RXD, NANO_TXD

### Nets
GND: C41.1 C48.1 C60.1 C143.1 IC5.5(GND) IC10.4(GND) IC11.4(GND) IC24.3(DIN2RIN-) IC24.4(GND) IC40.7(GND) R172.1 R221.1 T7.2(S)
P3V3: C41.2 C48.2 C60.2 C143.2 IC5.8(VCC) IC10.1(VCC) IC11.1(VCC) IC24.1(VCC) IC40.14(VCC) R173.2
A2: R36.1 R221.2 T7.1(G) ; port SPEC/GPSDOn
D3: R34.1 ; port OCXO_READY
D4: R118#1.1 ; port PLL_LOCK
EEM_IO.LVDS_N1: IC24.7(DOUT-)
EEM_IO.LVDS_N2: IC10.7(DOUT-)
EEM_IO.LVDS_N3: IC5.1(RIN1-) R16.1
EEM_IO.LVDS_N4: IC10.5(DOUT-)
EEM_IO.LVDS_N5: IC5.4(RIN2-) R18.2
EEM_IO.LVDS_N6: IC11.7(DOUT-)
EEM_IO.LVDS_N7: IC11.5(DOUT-)
EEM_IO.LVDS_P1: IC24.8(DOUT+)
EEM_IO.LVDS_P2: IC10.8(DOUT+)
EEM_IO.LVDS_P3: IC5.2(RIN1+) R16.2
EEM_IO.LVDS_P4: IC10.6(DOUT+)
EEM_IO.LVDS_P5: IC5.3(RIN2+) R18.1
EEM_IO.LVDS_P6: IC11.8(DOUT+)
EEM_IO.LVDS_P7: IC11.6(DOUT+)
PLL_CTRL_RX: R31.1 ; port PLL_CTRL_RX
PLL_CTRL_TX: R143#1.1 ; port PLL_CTRL_TX
SPECn/GPSDO: IC40.6(E) R173.1 T7.3(D)
NetIC5_6: IC5.6(ROUT2) R31.2
NetIC5_7: IC5.7(ROUT1) R17.2
NetIC10_2: IC10.2(DIN1) R118#1.2
NetIC10_3: IC10.3(DIN2RIN-) R14.2
NetIC11_2: IC11.2(DIN1) R34.2
NetIC11_3: IC11.3(DIN2RIN-) R36.2
NetIC24_2: IC24.2(DIN1) R143#1.2
NetIC40_8: IC40.8(Y) R17.1
NetIC40_9: IC40.9(Z) ; port GPSDO.NANO_RXD
NetR14_1: R14.1 R172.2 ; port GPSDO.NANO_TXD

Not connected (* = marked no-connect by the designer): IC24 5(DOUT-)* 6(DOUT+)*

### Buses and harness runs
bus EEM_IO.LVDS_N[0..15]
bus EEM_IO.LVDS_P[0..15]
harness EEM_IO = port EEM_IO

### Layout directives
differential pair; differential pair class Diff_100Ohm: (no net found under the mark)

### Notes on the sheet
- RXD Path connected only when GPSDO present, to avoid collision on shared pins
- Project/Equipment
- Document
- Designer
- Drawn by
- Check.by
- Copyright WUT ISE 2020.
  This documentation describes Open Hardware and is licensed under the CERN OHL v.1.2. You may redistribute and modify this documentation under the terms of the CERN OHL v.1.2. (http://ohwr.org/CERNOHL). This documentation is distributed WITHOUT ANY EXPRESS OR IMPLIED WARRANTY, INCLUDING OF MERCHANTABILITY, SATISFACTORY QUALITY AND FITNESS FOR A PARTICULAR PURPOSE. Please see the CERN OHL v.1.2 for applicable conditions.
- Contact
- File
- Last Mod.
- Print Date
- Sheet
- Size
- A3
- of
- Rev
- (in symbol R0402_10K_1%_0.0625W_100PPM) 1%
- (in symbol R0402_100R_1%_0.0625W_100PPM) 1%

### Library data of the parts
C41 C48 C60 C143 = CC0402_100NF_16V_10%_X5R: Non-polarised capacitor; Part Description: SMD Multilayer Chip Ceramic Capacitor; Manufacturer: GENERIC; Manufacturer1 Part Number: GRM155R61C104KA88D; Voltage: 16V; TC: X5R; Tolerance: ±10%; Part Number: CC0402_100NF_16V_10%_X5R; Component Kind: Standard; Component Type: Standard; Pin Count: 2; Value: 100nF; Status: None; Manufacturer Part Number: CC0402_100NF_16V_10%_X5R; Case: 0402; Mounted: Yes; Socket: No; SMD: Yes; Sense: No; Manufacturer1 Example: MURATA; Manufacturer1 ComponentHeight: 0.55mm; HelpURL: \\cern.ch\dfs\Applications\Altium\Datasheets\CC0402_X5R_MURATA_GRM.pdf; Author: CERN DEM JLC; CreateDate: 10.12.2013; LatestRevisionDate: 10.12.2013
IC5 = IFC_FIN1028: 3.3V LVDS 2-Bit High-Speed Differential Reciever; Manufacturer: ON Semiconductor; PressFit: No; Bonding: No; Part Number: FIN1028MX; Component Kind: Standard; Component Type: Standard; Device: FIN1028MX; PackageDescription: SOIC 8, Pitch 1.27mm - Body 4x5mm, IPC Medium Density; Part Description: 3.3V LVDS 2-Bit High-Speed Differential Reciever; Manufacturer Part Number: FIN1028MX; Pin Count: 8; Case: SOIC8; Mounted: Yes; Socket: No; SMD: Yes; Sense: No; ComponentHeight: 0.8mm; Author: GK; HelpURL: \\cern.ch\dfs\Applications\Altium\Datasheets\FIN1101K8X.pdf; CreateDate: 08/11/2016; LatestRevisionDate: 08/11/2016
IC10 IC11 IC24 = IFC_FIN1027A: 3.3V LVDS, 2-Bit, High-Speed, Differential Driver; Manufacturer: ON Semiconductor; PressFit: No; Bonding: No; Part Number: FIN1027AMX; Component Kind: Standard; Component Type: Standard; Device: FIN1027AMX; PackageDescription: SOIC 8, Pitch 1.27mm - Body 4x5mm, IPC Medium Density; Part Description: 3.3V LVDS, 2-Bit, High-Speed, Differential Driver; Manufacturer Part Number: FIN1027AMX; Pin Count: 8; Case: SOIC8; Mounted: Yes; Socket: No; SMD: Yes; Sense: No; ComponentHeight: 0.8mm; Author: GK; HelpURL: \\cern.ch\dfs\Applications\Altium\Datasheets\FIN1101K8X.pdf; CreateDate: 08/11/2016; LatestRevisionDate: 08/11/2016
IC40 = 74HC4066PW: Part Description: Quad Single-Pole Single-Throw Analog Switch; Manufacturer: NXP SEMICONDUCTORS; PressFit: No; Bonding: No; Table: Standard Logic; Part Number: 74HC4066PW; Component Kind: Standard; Component Type: Standard; Device: 74HC4066PW; PackageDescription: SOP, 14-Leads, Body 4.4x5mm (max), Pitch 0.65mm, IPC Medium Density; Manufacturer Part Number: 74HC4066PW; Pin Count: 14; Case: TSSOP14; Mounted: Yes; Socket: No; SMD: Yes; ComponentHeight: 1.1mm; Author: CERN DEM JLC; HelpURL: \\cern.ch\dfs\Applications\Altium\Datasheets\74HC4066PW.pdf; CreateDate: 2014-11-19; LatestRevisionDate: 2014-11-19
R14 R16-R18 R31 R34 R36 R118#1 R143#1 = R0402_100R_1%_0.0625W_100PPM: Resistor - 1%; Part Description: General Purpose Thick Film Chip Resistor; Manufacturer: GENERIC; Manufacturer1 Part Number: 232270671001L; TC: ±100ppm/°C; PressFit: No; Part Number: R0402_100R_1%_0.0625W_100PPM; Component Kind: Standard; Component Type: Standard; Pin Count: 2; Value: 100; Status: Not Recommended; Power: 0.0625W; Tolerance: ±1%; Manufacturer Part Number: R0402_100R_1%_0.0625W_100PPM; Case: 0402; Mounted: Yes; Sense: No; Socket: No; SMD: Yes; Manufacturer1 Example: YAGEO PHYCOMP; Manufacturer1 ComponentHeight: 0.4mm; HelpURL: \\cern.ch\dfs\Applications\Altium\Datasheets\R0402_Phycomp_RC0402.pdf; Author: CERN DEM JLC; CreateDate: 03.12.2007; LatestRevisionDate: 17.10.2012
R172 R173 R221 = R0402_10K_1%_0.0625W_100PPM: as R72#1 on sheet Wenzel_REF; Part Number: R0402_10K_1%_0.0625W_100PPM; Component Kind: Standard; Component Type: Standard; Pin Count: 2; Value: 10k; Status: Not Recommended; Power: 0.0625W; Tolerance: ±1%; Manufacturer Part Number: R0402_10K_1%_0.0625W_100PPM; Case: 0402; Mounted: Yes; Sense: No; Socket: No; SMD: Yes; Manufacturer1 Example: YAGEO PHYCOMP; Manufacturer1 ComponentHeight: 0.4mm; HelpURL: \\cern.ch\dfs\Applications\Altium\Datasheets\R0402_Phycomp_RC0402.pdf; Author: CERN DEM JLC; CreateDate: 03.12.2007; LatestRevisionDate: 17.10.2012
T7 = BSH103: as T6 on sheet Wenzel_REF; Part Number: BSH103; Component Kind: Standard; Component Type: Standard; Device: BSH103; PackageDescription: SOT23, 0.95mm Pitch; 3 Pin, 1.30mm W X 2.90mm L X 1.10mm H body, IPC Medium Density; Manufacturer Part Number: BSH103; Pin Count: 3; Case: SOT23-3; Mounted: Yes; Socket: No; SMD: Yes; Sense: No; ComponentHeight: 1.1mm; HelpURL: \\cern.ch\dfs\Applications\Altium\Datasheets\BSH103.pdf; Author: CERN DEM JLC; CreateDate: 16.03.2010; LatestRevisionDate: 20.06.2017

## Sheet Clock_fanout.SchDoc: =SheetTitle_Top
size 420 x 297 mm; Author: G.Kasprowicz; CompanyName: WUT ISE; DrawnBy: G.Kasprowicz; Organization: WUT ISE; Address1: PW ISE; Address2: Nowowiejska 15/19 00-665 Warsaw; Address3: gkasprow@gmail.com; Revision: 1.1; ModifiedBy: -; CheckedDate: -; Title2: Clock Fanout; DivGrp: WUT ISE; Designer: G.Kasprowicz; ModifiedDate: -; ProjectName: Sensor Box
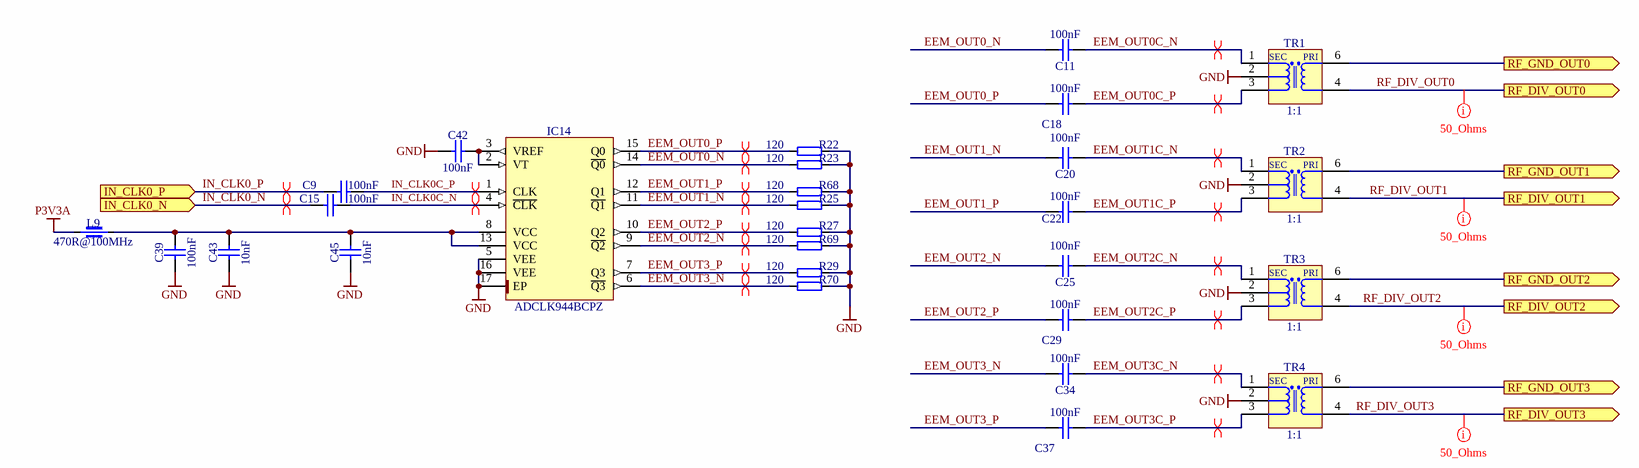
[diagram p2: Clock_fanout.SchDoc]

### Parts
C9  100nF  [CAPC1005X55N]
C11  100nF  [CAPC1005X55N]
C15  100nF  [CAPC1005X55N]
C18  100nF  [CAPC1005X55N]
C20  100nF  [CAPC1005X55N]
C22  100nF  [CAPC1005X55N]
C25  100nF  [CAPC1005X55N]
C29  100nF  [CAPC1005X55N]
C34  100nF  [CAPC1005X55N]
C37  100nF  [CAPC1005X55N]
C39  100nF  [CAPC1005X55N]
C42  100nF  [CAPC1005X55N]
C43  10nF  [CAPC1005X55N]
C45  10nF  [CAPC1005X55N]
IC14  ADCLK944BCPZ  [QFN50P300X300X80-17N-S160]
L9  470R@100MHz  [INDC1608X95N]
R22  120  [RESC1005X40N]
R23  120  [RESC1005X40N]
R25  120  [RESC1005X40N]
R27  120  [RESC1005X40N]
R29  120  [RESC1005X40N]
R68  120  [RESC1005X40N]
R69  120  [RESC1005X40N]
R70  120  [RESC1005X40N]
TR1  1:1  [XFMR_MINI-CIRCUITS_AT1521]
TR2  1:1  [XFMR_MINI-CIRCUITS_AT1521]
TR3  1:1  [XFMR_MINI-CIRCUITS_AT1521]
TR4  1:1  [XFMR_MINI-CIRCUITS_AT1521]

### Ports
IN_CLK0_N (in), IN_CLK0_P (in), RF_DIV_OUT0 (out), RF_DIV_OUT1 (out), RF_DIV_OUT2 (out), RF_DIV_OUT3 (out), RF_GND_OUT0 (out), RF_GND_OUT1 (out), RF_GND_OUT2 (out), RF_GND_OUT3 (out)

### Nets
GND: C39.1 C42.1 C43.1 C45.1 IC14.5(VEE) IC14.16(VEE) IC14.17(EP) R22.2 R23.2 R25.2 R27.2 R29.2 R68.2 R69.2 R70.2 TR1.2(NC) TR2.2(NC) TR3.2(NC) TR4.2(NC)
P3V3A: L9.1
EEM_OUT0_N: C11.2 IC14.14(~{Q0}) R23.1
EEM_OUT0_P: C18.2 IC14.15(Q0) R22.1
EEM_OUT0C_N: C11.1 TR1.1(SDOT)
EEM_OUT0C_P: C18.1 TR1.3(S)
EEM_OUT1_N: C20.2 IC14.11(~{Q1}) R25.1
EEM_OUT1_P: C22.2 IC14.12(Q1) R68.1
EEM_OUT1C_N: C20.1 TR2.1(SDOT)
EEM_OUT1C_P: C22.1 TR2.3(S)
EEM_OUT2_N: C25.2 IC14.9(~{Q2}) R69.1
EEM_OUT2_P: C29.2 IC14.10(Q2) R27.1
EEM_OUT2C_N: C25.1 TR3.1(SDOT)
EEM_OUT2C_P: C29.1 TR3.3(S)
EEM_OUT3_N: C34.2 IC14.6(~{Q3}) R70.1
EEM_OUT3_P: C37.2 IC14.7(Q3) R29.1
EEM_OUT3C_N: C34.1 TR4.1(SDOT)
EEM_OUT3C_P: C37.1 TR4.3(S)
IN_CLK0_N: C15.1 ; port IN_CLK0_N
IN_CLK0_P: C9.1 ; port IN_CLK0_P
IN_CLK0C_N: C15.2 IC14.4(~{CLK})
IN_CLK0C_P: C9.2 IC14.1(CLK)
RF_DIV_OUT0: TR1.4(P) ; port RF_DIV_OUT0
RF_DIV_OUT1: TR2.4(P) ; port RF_DIV_OUT1
RF_DIV_OUT2: TR3.4(P) ; port RF_DIV_OUT2
RF_DIV_OUT3: TR4.4(P) ; port RF_DIV_OUT3
RF_GND_OUT0: TR1.6(PDOT) ; port RF_GND_OUT0
RF_GND_OUT1: TR2.6(PDOT) ; port RF_GND_OUT1
RF_GND_OUT2: TR3.6(PDOT) ; port RF_GND_OUT2
RF_GND_OUT3: TR4.6(PDOT) ; port RF_GND_OUT3
NetC39_2: C39.2 C43.2 C45.2 IC14.8(VCC) IC14.13(VCC) L9.2
NetC42_2: C42.2 IC14.2(VT) IC14.3(VREF)

### Layout directives
differential pair: EEM_OUT0_N, EEM_OUT0_P, EEM_OUT0C_N, EEM_OUT0C_P, EEM_OUT1_N, EEM_OUT1_P, EEM_OUT1C_N, EEM_OUT1C_P, EEM_OUT2_N, EEM_OUT2_P, EEM_OUT2C_N, EEM_OUT2C_P, EEM_OUT3_N, EEM_OUT3_P, EEM_OUT3C_N, EEM_OUT3C_P, IN_CLK0_N, IN_CLK0_P, IN_CLK0C_N, IN_CLK0C_P
net class 50_Ohms: RF_DIV_OUT0, RF_DIV_OUT1, RF_DIV_OUT2, RF_DIV_OUT3

### Notes on the sheet
- Project/Equipment
- Document
- Designer
- Drawn by
- Check.by
- Copyright WUT ISE 2020.
  This documentation describes Open Hardware and is licensed under the CERN OHL v.1.2. You may redistribute and modify this documentation under the terms of the CERN OHL v.1.2. (http://ohwr.org/CERNOHL). This documentation is distributed WITHOUT ANY EXPRESS OR IMPLIED WARRANTY, INCLUDING OF MERCHANTABILITY, SATISFACTORY QUALITY AND FITNESS FOR A PARTICULAR PURPOSE. Please see the CERN OHL v.1.2 for applicable conditions.
- Contact
- File
- Last Mod.
- Print Date
- Sheet
- Size
- A3
- of
- Rev
- (in symbol XFMR_MINI-CIRCUITS_TC2-1TX+) SEC; PRI

### Library data of the parts
C9 C11 C15 C18 C20 C22 C25 C29 C34 C37 C39 C42 = CC0402_100NF_16V_10%_X5R: as C41 on sheet Drivers; Part Number: CC0402_100NF_16V_10%_X5R; Component Kind: Standard; Component Type: Standard; Pin Count: 2; Value: 100nF; Status: None; Manufacturer Part Number: CC0402_100NF_16V_10%_X5R; Case: 0402; Mounted: Yes; Socket: No; SMD: Yes; Sense: No; Manufacturer1 Example: MURATA; Manufacturer1 ComponentHeight: 0.55mm; HelpURL: \\cern.ch\dfs\Applications\Altium\Datasheets\CC0402_X5R_MURATA_GRM.pdf; Author: CERN DEM JLC; CreateDate: 10.12.2013; LatestRevisionDate: 10.12.2013
C43 C45 = CC0402_10NF_16V_10%_X7R: as C140#1 on sheet Wenzel_REF; Part Number: CC0402_10NF_16V_10%_X7R; Component Kind: Standard; Component Type: Standard; Pin Count: 2; Value: 10nF; Status: Not Recommended; Manufacturer Part Number: CC0402_10NF_16V_10%_X7R; Case: 0402; Mounted: Yes; Socket: No; SMD: Yes; Sense: No; Manufacturer1 Example: PHYCOMP; Manufacturer1 ComponentHeight: 0.55mm; HelpURL: \\cern.ch\dfs\Applications\Altium\Datasheets\CC0402_X7R_PHYCOMP.pdf; Author: CERN DEM JLC; CreateDate: 03.12.2007; LatestRevisionDate: 03.12.2007
IC14 = ADCLK944BCPZ: 2.5V/3.3V, Four LVPECL Outputs, SiGe Clock Fanout Buffer; Manufacturer: ANALOG DEVICES; PressFit: No; Bonding: No; Part Number: ADCLK944BCPZ; Component Kind: Standard; Component Type: Standard; Device: ADCLK944BCPZ; PackageDescription: QFN, 0.50mm Pitch, Square; 16 Pin, 3.00mm L X 3.00mm W X 0.80mm H body (w/Thermal Tab 1.60 X 1.60mm), IPC Medium Density; Part Description: 2.5V/3.3V, Four LVPECL Outputs, SiGe Clock Fanout Buffer; Manufacturer Part Number: ADCLK944BCP; Pin Count: 17; Case: QFN16; Mounted: Yes; Socket: No; SMD: Yes; Sense: No; ComponentHeight: 0.8mm; Author: CERN DEM JLC; HelpURL: \\cern.ch\dfs\Applications\Altium\Datasheets\ADCLK944BCPZ.pdf; CreateDate: 17.07.2014; LatestRevisionDate: 25.03.2022
L9 = IND0603_MURATA_BLM18PG471SN1D: Part Description: SMD EMIFIL Chip Ferrite Bead; Manufacturer: MURATA; Power: 1A; Resistance: 0.2R; Tolerance: ±25%; Part Number: IND0603_MURATA_BLM18PG471SN1D; Component Kind: Standard; Component Type: Standard; Pin Count: 2; Value: 470R@100MHz; Manufacturer Part Number: BLM18PG471SN1D; Case: 0603; Mounted: Yes; Socket: No; SMD: Yes; Sense: No; ComponentHeight: 0.95mm; HelpURL: \\cern.ch\dfs\Applications\Altium\Datasheets\IND0603_MURATA_BLM18P.pdf; Author: CERN DEM BC; CreateDate: 17.02.2021; LatestRevisionDate: 17.02.2021
R22 R23 R25 R27 R29 R68-R70 = R0402_120R_1%_0.0625W_100PPM: Resistor - 1%; Part Description: General Purpose Thick Film Chip Resistor; Manufacturer: GENERIC; Manufacturer1 Part Number: 232270671201L; TC: ±100ppm/°C; PressFit: No; Part Number: R0402_120R_1%_0.0625W_100PPM; Component Kind: Standard; Component Type: Standard; Pin Count: 2; Value: 120; Status: Not Recommended; Power: 0.0625W; Tolerance: ±1%; Manufacturer Part Number: R0402_120R_1%_0.0625W_100PPM; Case: 0402; Mounted: Yes; Sense: No; Socket: No; SMD: Yes; Manufacturer1 Example: YAGEO PHYCOMP; Manufacturer1 ComponentHeight: 0.4mm; HelpURL: \\cern.ch\dfs\Applications\Altium\Datasheets\R0402_Phycomp_RC0402.pdf; Author: CERN DEM JLC; CreateDate: 03.12.2007; LatestRevisionDate: 17.10.2012
TR1-TR4 = XFMR_MINI-CIRCUITS_TC2-1TX+: 50 Ohms 3 to 300MHz RF Transformer; Part Number: XFMR_MINI-CIRCUITS_TC2-1TX+; Component Kind: Standard; Component Type: Standard; Pin Count: 5; Value: 1:1; Status: None; Part Description: 50 Ohms 3 to 300MHz RF Transformer; Manufacturer: MINI-CIRCUITS; Manufacturer Part Number: TC2-1TX+; Mounted: Yes; Socket: No; Sense: No; SMD: Yes; ComponentHeight: 4.06mm; HelpURL: \\cern.ch\dfs\Applications\Altium\Datasheets\XFMR_MINI-CIRCUITS_TC2-1TX+.pdf; Author: CERN DEM MR; CreateDate: 18.10.2019; LatestRevisionDate: 18.10.2019